# EAGLE schematic Alta (EAGLE 6.2)
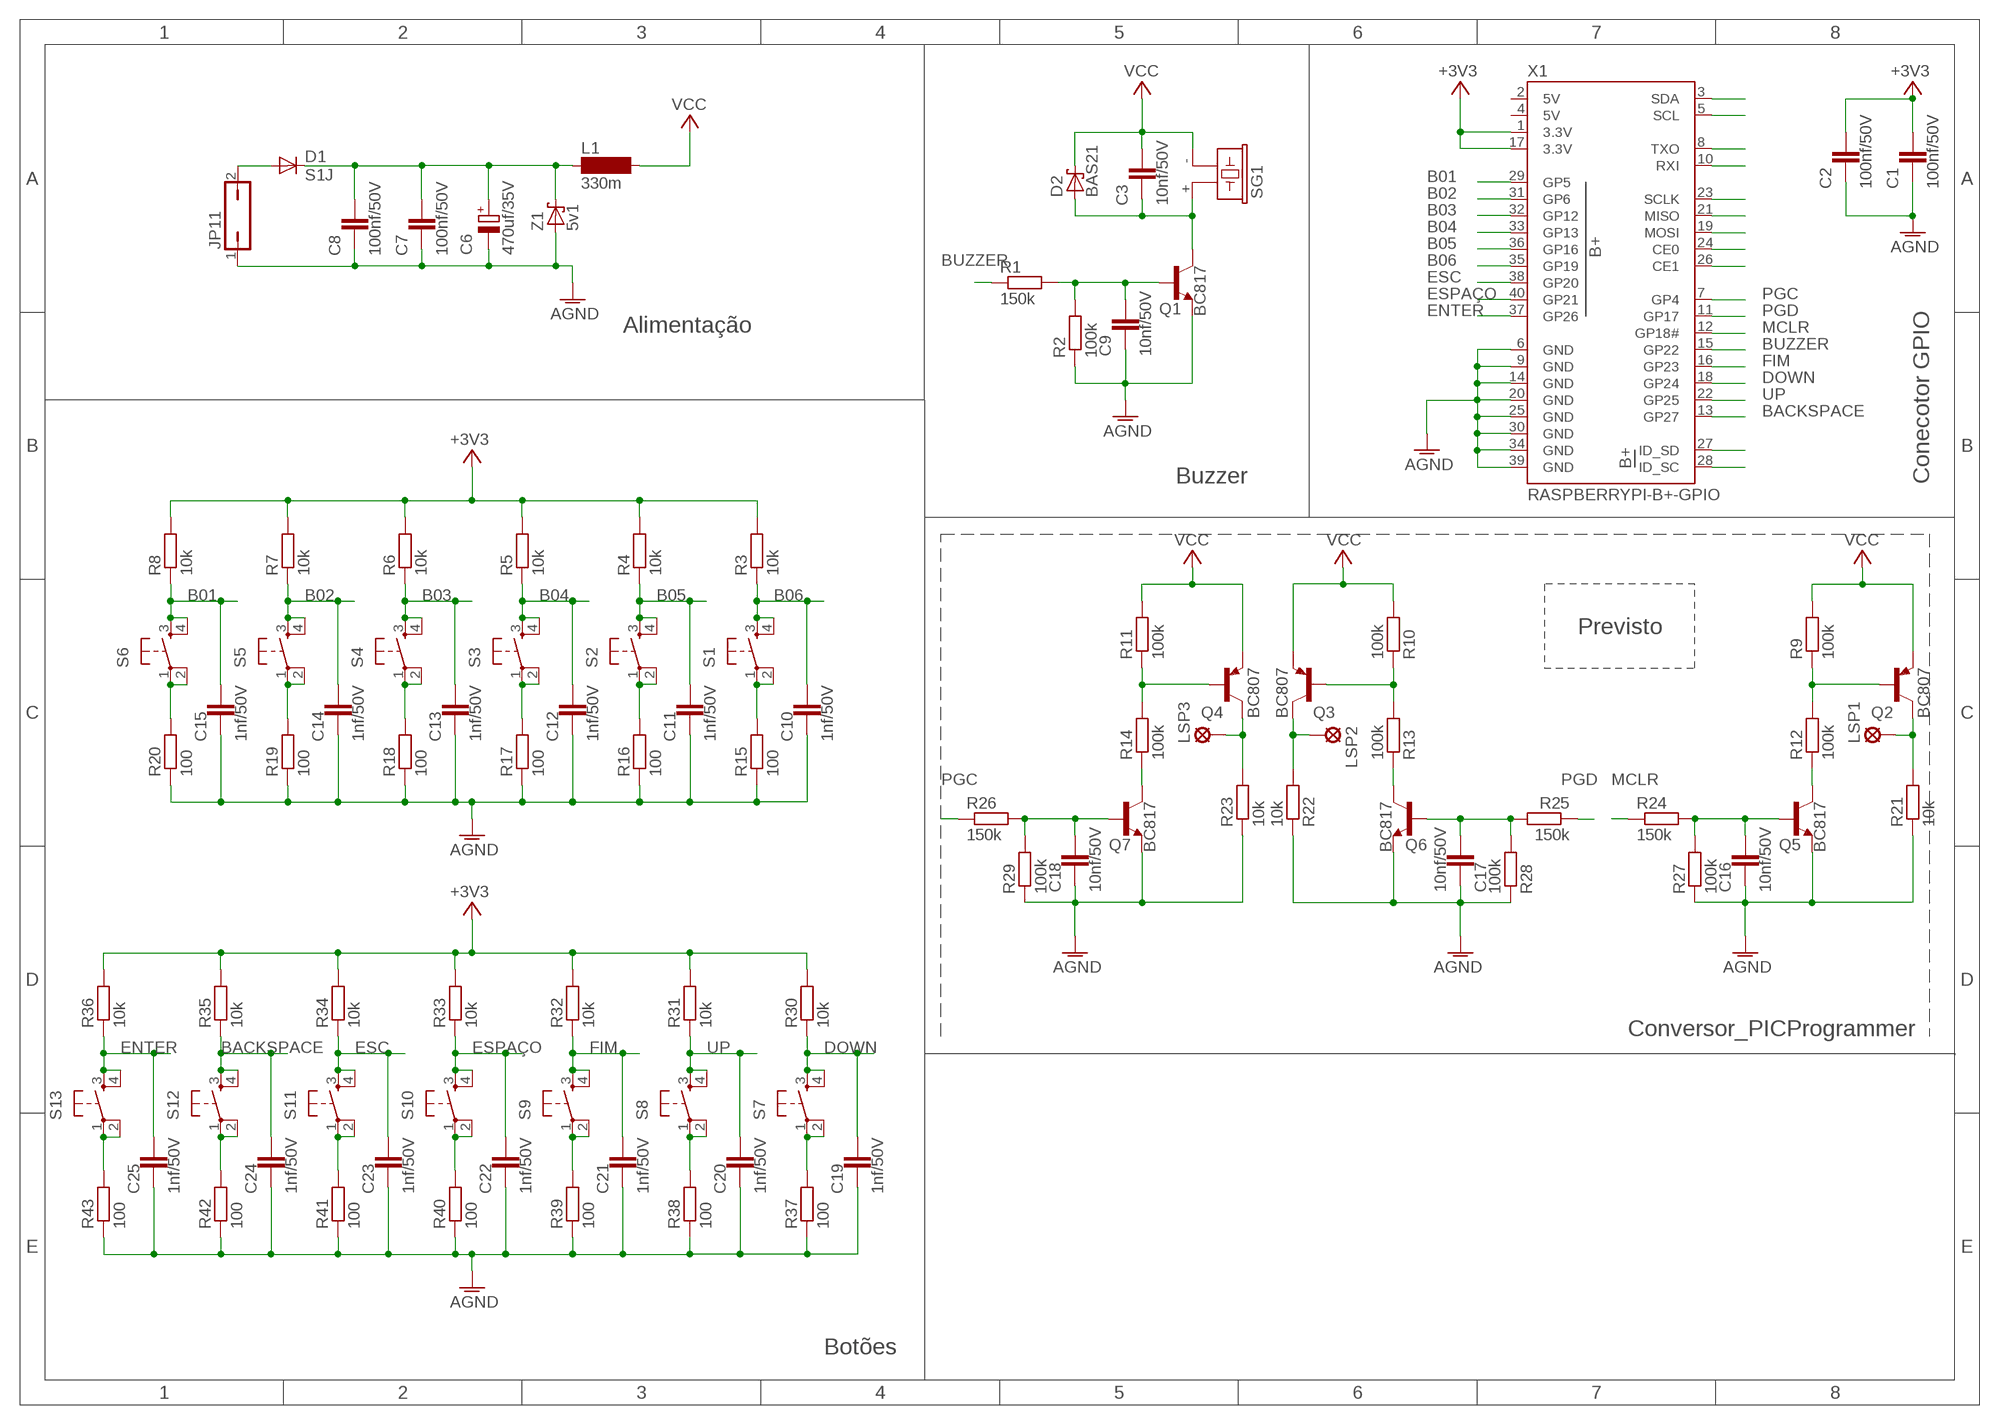
[diagram p0: schematic, sheet 1]

## Parts
C1  100nf/50V  C-EUC0603K  [C0603K]
C2  100nf/50V  C-EUC0603K  [C0603K]
C3  10nf/50V  C-EUC0603K  [C0603K]
C6  470uf/35V  CPOL-EU140CLH-1014  [140CLH-1014]
C7  100nf/50V  C-EUC0805  [C0805]
C8  100nf/50V  C-EUC0805  [C0805]
C9  10nf/50V  C-EUC0603K  [C0603K]
C10  1nf/50V  C-EUC0603K  [C0603K]
C11  1nf/50V  C-EUC0603K  [C0603K]
C12  1nf/50V  C-EUC0603K  [C0603K]
C13  1nf/50V  C-EUC0603K  [C0603K]
C14  1nf/50V  C-EUC0603K  [C0603K]
C15  1nf/50V  C-EUC0603K  [C0603K]
C16  10nf/50V  C-EUC0603K  [C0603K]
C17  10nf/50V  C-EUC0603K  [C0603K]
C18  10nf/50V  C-EUC0603K  [C0603K]
C19  1nf/50V  C-EUC0603K  [C0603K]
C20  1nf/50V  C-EUC0603K  [C0603K]
C21  1nf/50V  C-EUC0603K  [C0603K]
C22  1nf/50V  C-EUC0603K  [C0603K]
C23  1nf/50V  C-EUC0603K  [C0603K]
C24  1nf/50V  C-EUC0603K  [C0603K]
C25  1nf/50V  C-EUC0603K  [C0603K]
D1  S1J  DIODE-SMC  [SMC]
D2  BAS21  BAS40  [SOT23]
JP11  JP1Q  [JP1]
L1  330m  MS50  [MS50]
LSP1  LSP10  [LSP10]
LSP2  LSP10  [LSP10]
LSP3  LSP10  [LSP10]
Q1  BC817  BC817-16LT1SMD  [SOT23-BEC]
Q2  BC807  BC807-40SMD  [SOT23-BEC]
Q3  BC807  BC807-40SMD  [SOT23-BEC]
Q4  BC807  BC807-40SMD  [SOT23-BEC]
Q5  BC817  BC817-16LT1SMD  [SOT23-BEC]
Q6  BC817  BC817-16LT1SMD  [SOT23-BEC]
Q7  BC817  BC817-16LT1SMD  [SOT23-BEC]
R1  150k  R-EU_R0603  [R0603]
R2  100k  R-EU_R0603  [R0603]
R3  10k  R-EU_R0603  [R0603]
R4  10k  R-EU_R0603  [R0603]
R5  10k  R-EU_R0603  [R0603]
R6  10k  R-EU_R0603  [R0603]
R7  10k  R-EU_R0603  [R0603]
R8  10k  R-EU_R0603  [R0603]
R9  100k  R-EU_R0603  [R0603]
R10  100k  R-EU_R0603  [R0603]
R11  100k  R-EU_R0603  [R0603]
R12  100k  R-EU_R0603  [R0603]
R13  100k  R-EU_R0603  [R0603]
R14  100k  R-EU_R0603  [R0603]
R15  100  R-EU_R0603  [R0603]
R16  100  R-EU_R0603  [R0603]
R17  100  R-EU_R0603  [R0603]
R18  100  R-EU_R0603  [R0603]
R19  100  R-EU_R0603  [R0603]
R20  100  R-EU_R0603  [R0603]
R21  10k  R-EU_R0603  [R0603]
R22  10k  R-EU_R0603  [R0603]
R23  10k  R-EU_R0603  [R0603]
R24  150k  R-EU_R0603  [R0603]
R25  150k  R-EU_R0603  [R0603]
R26  150k  R-EU_R0603  [R0603]
R27  100k  R-EU_R0603  [R0603]
R28  100k  R-EU_R0603  [R0603]
R29  100k  R-EU_R0603  [R0603]
R30  10k  R-EU_R0603  [R0603]
R31  10k  R-EU_R0603  [R0603]
R32  10k  R-EU_R0603  [R0603]
R33  10k  R-EU_R0603  [R0603]
R34  10k  R-EU_R0603  [R0603]
R35  10k  R-EU_R0603  [R0603]
R36  10k  R-EU_R0603  [R0603]
R37  100  R-EU_R0603  [R0603]
R38  100  R-EU_R0603  [R0603]
R39  100  R-EU_R0603  [R0603]
R40  100  R-EU_R0603  [R0603]
R41  100  R-EU_R0603  [R0603]
R42  100  R-EU_R0603  [R0603]
R43  100  R-EU_R0603  [R0603]
S1  TAC_SWITCHSMD  [TACTILE-SWITCH-SMD]
S2  TAC_SWITCHSMD  [TACTILE-SWITCH-SMD]
S3  TAC_SWITCHSMD  [TACTILE-SWITCH-SMD]
S4  TAC_SWITCHSMD  [TACTILE-SWITCH-SMD]
S5  TAC_SWITCHSMD  [TACTILE-SWITCH-SMD]
S6  TAC_SWITCHSMD  [TACTILE-SWITCH-SMD]
S7  TAC_SWITCHSMD  [TACTILE-SWITCH-SMD]
S8  TAC_SWITCHSMD  [TACTILE-SWITCH-SMD]
S9  TAC_SWITCHSMD  [TACTILE-SWITCH-SMD]
S10  TAC_SWITCHSMD  [TACTILE-SWITCH-SMD]
S11  TAC_SWITCHSMD  [TACTILE-SWITCH-SMD]
S12  TAC_SWITCHSMD  [TACTILE-SWITCH-SMD]
S13  TAC_SWITCHSMD  [TACTILE-SWITCH-SMD]
SG1  F/CM12P  [F/CM12P]
X1  RASPBERRYPI-B+-GPIO  [2X20-SHROUDED]
Z1  5v1  BAS70  [SOT23]

## Nets
+3V3: C1.1 C2.1 R3.2 R4.2 R5.2 R6.2 R7.2 R8.2 R30.2 R31.2 R32.2 R33.2 R34.2 R35.2 R36.2 X1.1(3.3V) X1.17(3.3V)
AGND: C1.2 C2.2 C6.- C7.2 C8.2 C9.2 C10.2 C11.2 C12.2 C13.2 C14.2 C15.2 C16.2 C17.2 C18.2 C19.2 C20.2 C21.2 C22.2 C23.2 C24.2 C25.2 JP11.1 Q1.E Q5.E Q6.E Q7.E R2.1 R15.1 R16.1 R17.1 R18.1 R19.1 R20.1 R21.1 R22.1 R23.1 R27.1 R28.1 R29.1 R37.1 R38.1 R39.1 R40.1 R41.1 R42.1 R43.1 X1.6(GND) X1.9(GND) X1.14(GND) X1.20(GND) X1.25(GND) X1.30(GND) X1.34(GND) X1.39(GND) Z1.1(A)
B01: C15.1 R8.1 S6.3 S6.4 X1.29(GP5)
B02: C14.1 R7.1 S5.3 S5.4 X1.31(GP6)
B03: C13.1 R6.1 S4.3 S4.4 X1.32(GP12)
B04: C12.1 R5.1 S3.3 S3.4 X1.33(GP13)
B05: C11.1 R4.1 S2.3 S2.4 X1.36(GP16)
B06: C10.1 R3.1 S1.3 S1.4 X1.35(GP19)
BACKSPACE: C24.1 R35.1 S12.3 S12.4 X1.13(GP27)
BUZZER: R1.1 X1.15(GP22)
DOWN: C19.1 R30.1 S7.3 S7.4 X1.18(GP24)
ENTER: C25.1 R36.1 S13.3 S13.4 X1.37(GP26)
ESC: C23.1 R34.1 S11.3 S11.4 X1.38(GP20)
ESPAÇO: C22.1 R33.1 S10.3 S10.4 X1.40(GP21)
FIM: C21.1 R32.1 S9.3 S9.4 X1.16(GP23)
MCLR: R24.1 X1.12(GP18#)
N$76: D1.A JP11.2
N$77: C6.+ C7.1 C8.1 D1.C L1.1 Z1.3(C)
N$78: R20.2 S6.1 S6.2
N$79: R15.2 S1.1 S1.2
N$80: R16.2 S2.1 S2.2
N$81: R17.2 S3.1 S3.2
N$82: R18.2 S4.1 S4.2
N$83: R19.2 S5.1 S5.2
N$84: R43.2 S13.1 S13.2
N$86: R38.2 S8.1 S8.2
N$87: R39.2 S9.1 S9.2
N$88: R40.2 S10.1 S10.2
N$89: R41.2 S11.1 S11.2
N$90: R42.2 S12.1 S12.2
N$91: R37.2 S7.1 S7.2
N$92: C3.2 D2.1(A) Q1.C SG1.+
N$93: C9.1 Q1.B R1.2 R2.2
N$94: X1.28(ID_SC)
N$95: X1.27(ID_SD)
N$96: X1.26(CE1)
N$97: X1.24(CE0)
N$98: X1.19(MOSI)
N$99: X1.21(MISO)
N$100: X1.23(SCLK)
N$101: X1.10(RXI)
N$102: X1.8(TXO)
N$103: X1.5(SCL)
N$104: X1.3(SDA)
N$105: Q7.C R14.1
N$106: C18.1 Q7.B R26.2 R29.2
N$107: Q4.B R11.1 R14.2
N$108: LSP3.MP Q4.C R23.2
N$117: Q6.C R13.1
N$119: C17.1 Q6.B R25.2 R28.2
N$120: Q3.B R10.1 R13.2
N$121: LSP2.MP Q3.C R22.2
N$122: Q5.C R12.1
N$123: C16.1 Q5.B R24.2 R27.2
N$124: Q2.B R9.1 R12.2
N$125: LSP1.MP Q2.C R21.2
PGC: R26.1 X1.7(GP4)
PGD: R25.1 X1.11(GP17)
UP: C20.1 R31.1 S8.3 S8.4 X1.22(GP25)
VCC: C3.1 D2.3(C) L1.2 Q2.E Q3.E Q4.E R9.2 R10.2 R11.2 SG1.-

## Notes on the sheet
- Alimentação
- Buzzer | Conecotor GPIO
- Previsto
- Conversor_PICProgrammer
- Botões

## Power pins joined to a net without a drawn wire
5V: X1.2(5V) X1.4(5V)

## Library data of the parts
C1-C3 C7-C25 = rcl:C-EU: CAPACITOR, European symbol
C6 = rcl:CPOL-EU: POLARIZED CAPACITOR, European symbol
D1 = diode:DIODE-: DIODE
D2 = diode:BAS40: Silicon Schottky Diodes General-purpose diode for high-speed switching
JP11 = jumper:JP1Q: JUMPER
L1 = inductor-neosid:MS50: INDUCTOR SMD power inductor; OC_FARNELL: unknown; OC_NEWARK: unknown
LSP1-LSP3 = solpad:LSP10: SOLDER PAD drill 1.0 mm, distributor Buerklin, 12H555
Q1 Q5-Q7 = transistor-npn:BC817*: NPN Transistor
Q2-Q4 = transistor-pnp:BC807*: PNP Transistror
R1-R43 = rcl:R-EU_: RESISTOR, European symbol
S1-S13 = SparkFun-Electromechanical:TAC_SWITCH: Momentary Switch Button commonly used for reset or general input. Spark Fun Electronics SKU : COM-00097 SMT- SWCH-08247
SG1 = buzzer:F/CM12P: BUZZER Source: Buerklin; OC_FARNELL: unknown; OC_NEWARK: unknown
X1 = SparkFun-Boards:RASPBERRYPI-B+-GPIO: Raspberry Pi B+ GPIO Header 2x20 pin connector
Z1 = diode:BAS70: Silicon Schottky Diodes General-purpose diode for high-speed switching